# Altium schematic sheet Stepper_driver_lowcost.SchDoc
size B
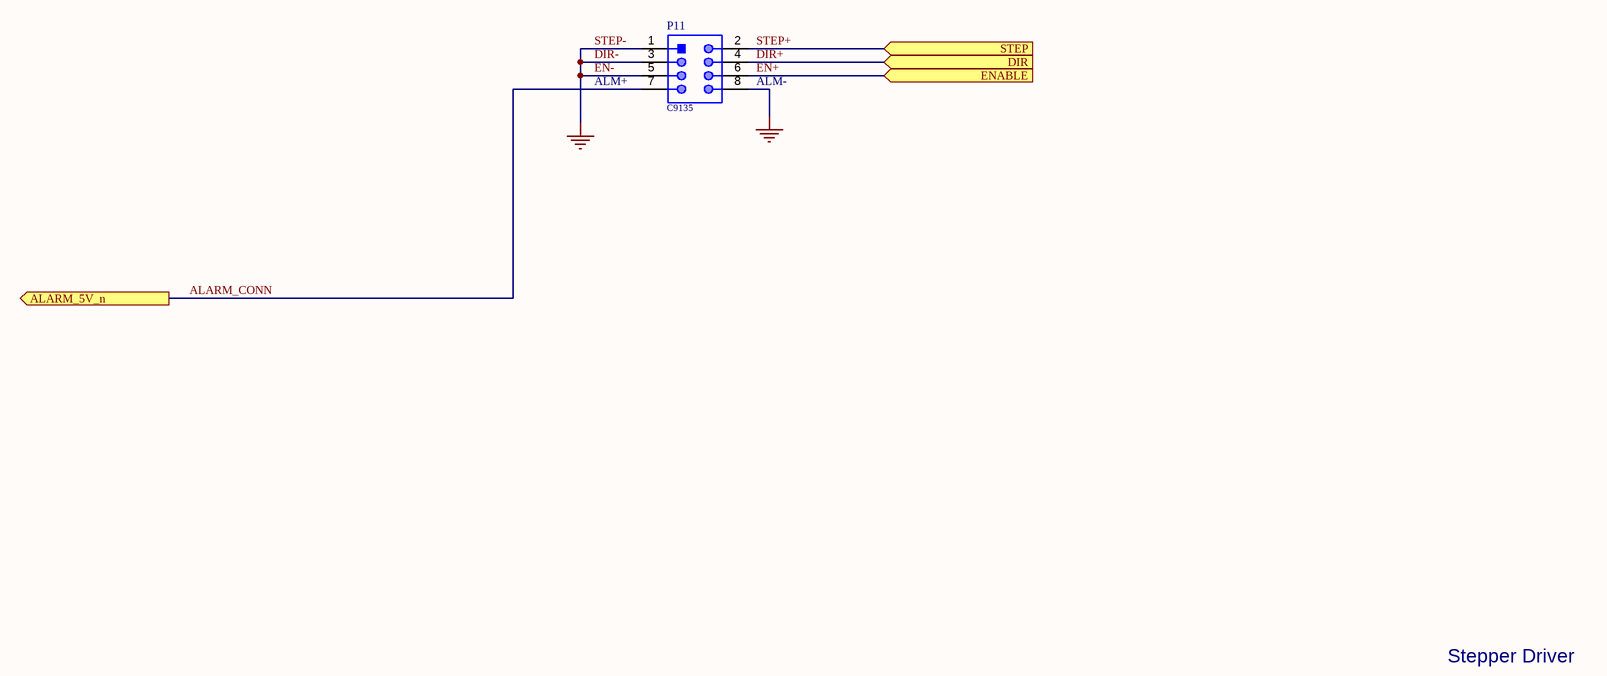
[diagram p0: Stepper_driver_lowcost.SchDoc]

## Parts
P11  C9135  [61200821621]

## Ports
ALARM_5V_n (out), DIR (in), ENABLE (in), STEP (in)

## Nets
DIR-: P11.1 P11.3 P11.5 P11.8  [also labelled EN-, GND, STEP-]
ALARM_CONN: P11.7 ; port ALARM_5V_n
DIR+: P11.4 ; port DIR
EN+: P11.6 ; port ENABLE
STEP+: P11.2 ; port STEP

## Notes on the sheet
- (near P11) ALM+
- (near P11) ALM-
- Stepper Driver
- SHEET
- Expatria Technologies
- 1136 Glade Court
- Port Coquitlam, BC V3B 1R5
- PHONE: (778) 238-9336
- PROJECT
- SIZE
- ENGR
- MODIFIED
- DOCUMENT
- REV
- This document contains confidential and proprietary information. No disclosure, reproduction, or transfer of this material in part or in its entirety shall be done without prior written approval.
- EMAIL: INFO@EXPATRIA.CA
- B
- /

## Library data of the parts
P11 = CMP-1502-00006-1: Male Box Header WR-BHD, THT, Vertical, pitch 2.54 mm, 8 pins; Manufacturer: Wurth Elektronik; Pitch: 2.54mm; Publisher: WurthElektronik; Part Number: C9135; Packaging: Tray; Published Date: August2018; Package Reference: 61200821621; SuppliersPartNumber: C9135